# EAGLE schematic ts5 (EAGLE 8.5.1)
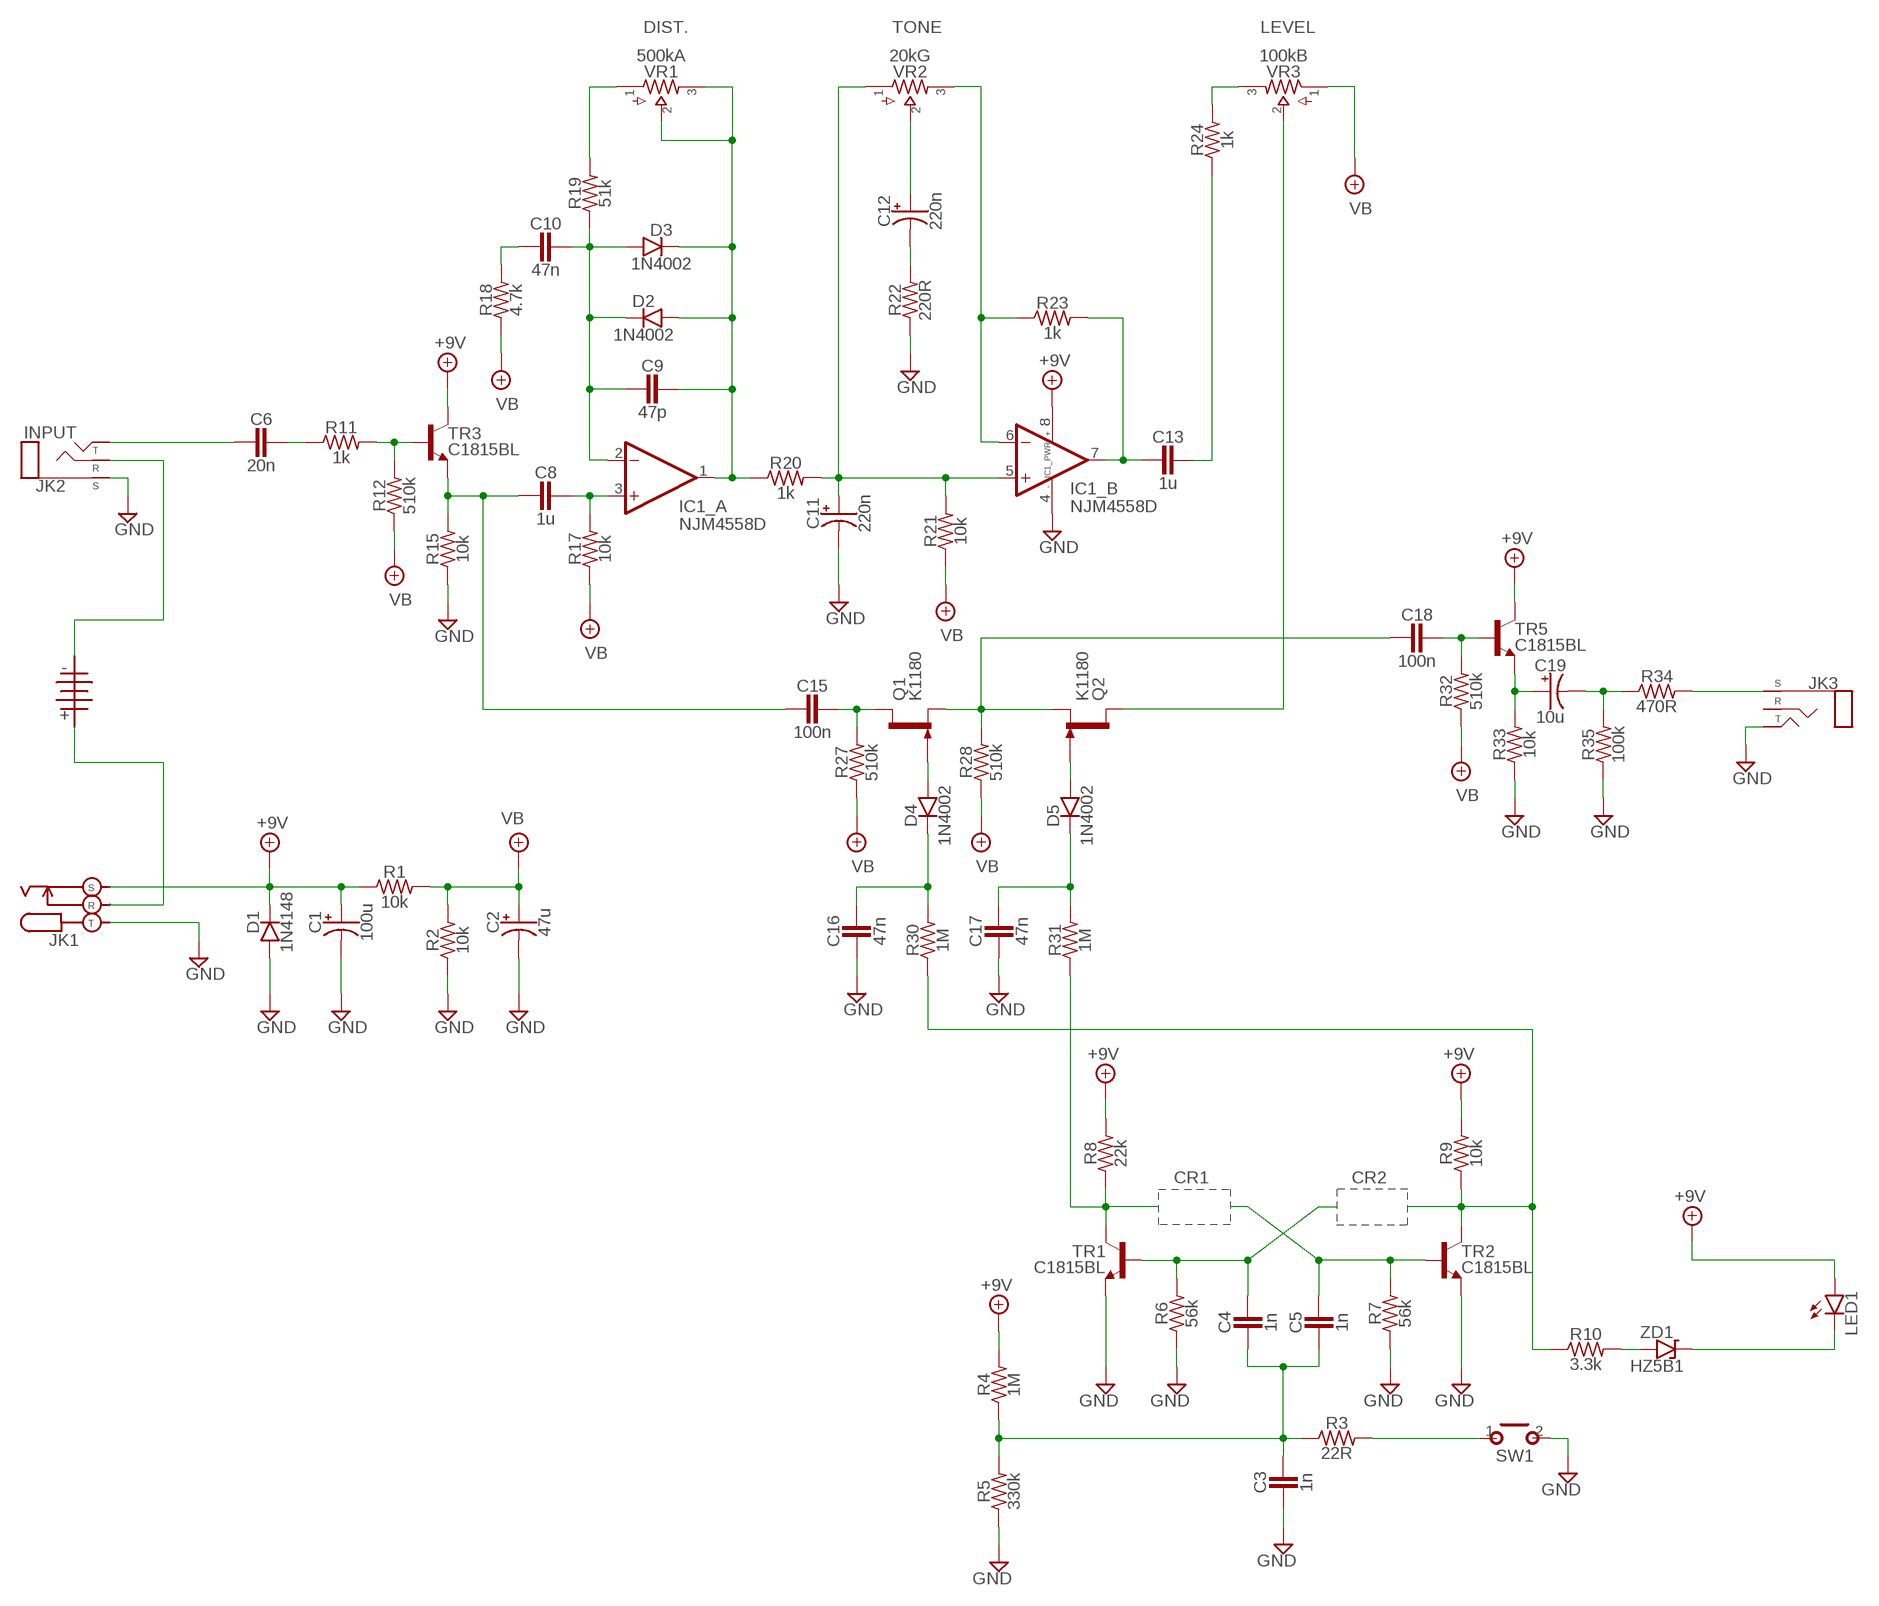
[diagram p0: schematic, sheet 1]

## Parts
1101  BATTERY  [TWO_PADS]
C1  100u  0500  [050_020]
C2  47u  0500  [050_020]
C3  1n  CER/FILMBOX.1  [BOX_SMALL]
C4  1n  CER/FILMBOX.1  [BOX_SMALL]
C5  1n  CER/FILMBOX.1  [BOX_SMALL]
C6  20n  CER/FILMBOX.1  [BOX_SMALL]
C8  1u  CER/FILMBOX.1  [BOX_SMALL]
C9  47p  CER/FILMBOX.1  [BOX_SMALL]
C10  47n  CER/FILMBOX.1  [BOX_SMALL]
C11  220n  0500  [050_020]
C12  220n  0500  [050_020]
C13  1u  CER/FILMBOX.1  [BOX_SMALL]
C15  100n  CER/FILMBOX.1  [BOX_SMALL]
C16  47n  CER/FILMBOX.1  [BOX_SMALL]
C17  47n  CER/FILMBOX.1  [BOX_SMALL]
C18  100n  CER/FILMBOX.1  [BOX_SMALL]
C19  10u  0500  [050_020]
D1  1N4148  DO35.2  [DO35-2]
D2  1N4002  DO35.2  [DO35-2]
D3  1N4002  DO35.2  [DO35-2]
D4  1N4002  DO35.2  [DO35-2]
D5  1N4002  DO35.2  [DO35-2]
IC1  NJM4558D  DUALTH  [DIL0]
JK1  DCJACK  DC_KOBICONN  [DC_KOBICONN]
JK2  INPUT  STEREO3PADS  [THREEPADS]
JK3  STEREO  [STEREO_PCB]
LED1  TLR124  LED  [3MM_D]
Q1  K1180  2N5457  [TO92-]
Q2  K1180  2N5457  [TO92-]
R1  10k  R_.3B  [R0207/3]
R2  10k  R_.3B  [R0207/3]
R3  22R  R_.3B  [R0207/3]
R4  1M  R_.3B  [R0207/3]
R5  330k  R_.3B  [R0207/3]
R6  56k  R_.3B  [R0207/3]
R7  56k  R_.3B  [R0207/3]
R8  22k  R_.3B  [R0207/3]
R9  10k  R_.3B  [R0207/3]
R10  3.3k  R_.3B  [R0207/3]
R11  1k  R_.3B  [R0207/3]
R12  510k  R_.3B  [R0207/3]
R15  10k  R_.3B  [R0207/3]
R17  10k  R_.3B  [R0207/3]
R18  4.7k  R_.3B  [R0207/3]
R19  51k  R_.3B  [R0207/3]
R20  1k  R_.3B  [R0207/3]
R21  10k  R_.3B  [R0207/3]
R22  220R  R_.3B  [R0207/3]
R23  1k  R_.3B  [R0207/3]
R24  1k  R_.3B  [R0207/3]
R27  510k  R_.3B  [R0207/3]
R28  510k  R_.3B  [R0207/3]
R30  1M  R_.3B  [R0207/3]
R31  1M  R_.3B  [R0207/3]
R32  510k  R_.3B  [R0207/3]
R33  10k  R_.3B  [R0207/3]
R34  470R  R_.3B  [R0207/3]
R35  100k  R_.3B  [R0207/3]
SW1  MOMENTARY  [SPST]
TR1  C1815BL  2SC828A  [TO92-]
TR2  C1815BL  2SC828A  [TO92-]
TR3  C1815BL  2N3904  [TO92-]
TR5  C1815BL  2N3904  [TO92-]
VR1  500kA  POTS16MM  [16MM]
VR2  20kG  POTS16MM  [16MM]
VR3  100kB  POTS16MM  [16MM]
ZD1  HZ5B1  ZENER.2  [DO41-2]

## Nets
+9V: C1.+ D1.C IC1.8(_PWR:V+) JK1.S LED1.ANODE(A) R1.1 R4.2 R8.2 R9.2 TR3.1(C) TR5.1(C)
GND: C1.- C2.- C3.2 C11.- C16.2 C17.2 D1.A IC1.4(_PWR:V-) JK1.T JK2.SLEEVE(S) JK3.P$3(T) R2.1 R5.1 R6.1 R7.1 R15.1 R22.1 R33.1 R35.1 SW1.2(S) TR1.3(E) TR2.3(E)
N$1: C6.2 JK2.TIP(T)
N$2: 1101.S JK2.RING(R)
N$3: R11.2 R12.2 TR3.2(B)
N$4: C8.2 C15.2 R15.2 TR3.3(E)
N$5: C8.1 IC1.3(_A:+IN) R17.2
N$6: C9.2 C10.1 D2.C D3.A IC1.2(_A:-IN) R19.1
N$7: R19.2 VR1.1
N$8: C9.1 D2.A D3.C IC1.1(_A:OUT) R20.1 VR1.2 VR1.3
N$9: C10.2 R18.2
N$10: C11.+ IC1.5(_B:+IN) R20.2 R21.2 VR2.1
N$11: IC1.6(_B:-IN) R23.1 VR2.3
N$12: C13.2 IC1.7(_B:OUT) R23.2
N$13: C19.- R34.1 R35.2
N$14: C12.+ VR2.2
N$15: C12.- R22.2
N$16: R24.2 VR3.3
N$17: Q2.3(D) VR3.2
N$18: C15.1 Q1.3(D) R27.2
N$19: C18.2 Q1.2(S) Q2.2(S) R28.2
N$20: D5.A Q2.1(G)
N$21: C17.1 D5.C R31.2
N$22: C13.1 R24.1
N$23: C18.1 R32.2 TR5.2(B)
N$24: C19.+ R33.2 TR5.3(E)
N$25: JK3.P$1(S) R34.2
N$26: C3.1 C4.2 C5.2 R3.1 R4.1 R5.2
N$27: D4.A Q1.1(G)
N$29: R9.1 R10.1 R30.1 TR2.2(C)
N$30: C16.1 D4.C R30.2
N$31: R8.1 R31.1 TR1.2(C)
N$32: C5.1 R7.2 TR2.1(B)
N$33: C6.1 R11.1
N$34: C4.1 R6.2 TR1.1(B)
N$35: R3.2 SW1.1(P)
N$36: 1101.T JK1.R
N$37: R10.2 ZD1.A
N$38: LED1.P$1(C) ZD1.C
VB: C2.+ R1.2 R2.2 R12.1 R17.1 R18.1 R21.1 R27.1 R28.1 R32.1 VR3.1
Unconnected: JK3.P$2(R)

## Notes on the sheet
- DIST. | TONE | LEVEL
- CR1 | CR2

## Library data of the parts
1101 = pedals-jacks:BATTERY
C1 C2 C11 C12 C19 = pedals-capacitors-elec:050
C3-C6 C8-C10 C13 C15-C18 = pedals-capacitors-film:CER/FILM: 47 - 120pF Xicon Ceramic Disc 2.5mm lead spacing
D1-D5 = pedals-diodes:DO35: DO-35 Package Diodes: 1N914
IC1 = pedals-integrated circuits:DUAL: OP AMP
JK1 = pedals-jacks:DC_KOBICONN
JK2 JK3 = pedals-jacks:STEREO
LED1 = pedals-diodes:LED
Q1 Q2 = pedals-transistors:2N5457: N-CHANNEL JFET
R1-R12 R15 R17-R24 R27 R28 R30-R35 = pedals-resistors:R_
SW1 = pedals-switches:MOMENTARY
TR1 TR2 = pedals-transistors:2SC828A
TR3 TR5 = pedals-transistors:2N3904: NPN Transistor
VR1-VR3 = pedals-potentiometers:POTS
ZD1 = pedals-diodes:ZENER